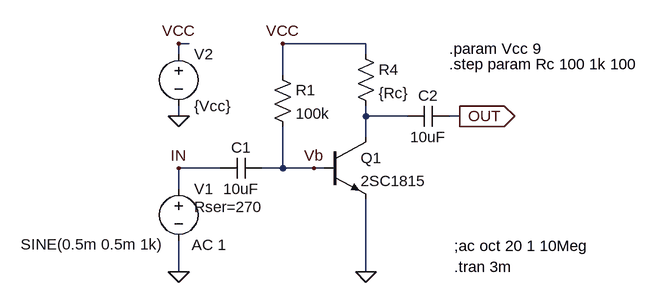
[diagram p0: schematic Fixed Base Biasing.asc]
Fixed Base Biasing.asc, the LTspice schematic file:
Version 4
SHEET 1 880 680
WIRE 16 -16 0 -16
WIRE 288 -16 160 -16
WIRE 0 0 0 -16
WIRE 288 0 288 -16
WIRE 160 32 160 -16
WIRE 0 96 0 80
WIRE 288 96 288 80
WIRE 352 96 288 96
WIRE 432 96 416 96
WIRE 288 128 288 96
WIRE 64 176 0 176
WIRE 160 176 160 112
WIRE 160 176 128 176
WIRE 208 176 160 176
WIRE 224 176 208 176
WIRE 0 208 0 176
WIRE 0 336 0 288
WIRE 288 336 288 224
FLAG 0 336 0
FLAG 288 336 0
FLAG 432 96 OUT
IOPIN 432 96 Out
FLAG 160 -16 VCC
FLAG 0 96 0
FLAG 0 -16 VCC
FLAG 0 176 IN
FLAG 208 176 Vb
SYMBOL npn 224 128 R0
SYMATTR InstName Q1
SYMATTR Value 2SC1815
SYMBOL cap 128 160 R90
WINDOW 0 0 32 VBottom 2
WINDOW 3 32 32 VTop 2
SYMATTR InstName C1
SYMATTR Value 10uF
SYMBOL res 144 16 R0
SYMATTR InstName R1
SYMATTR Value 100k
SYMBOL voltage 0 192 R0
WINDOW 3 -24 101 Right 2
WINDOW 123 20 102 Left 2
WINDOW 39 24 44 Left 2
SYMATTR Value SINE(0.5m 0.5m 1k)
SYMATTR Value2 AC 1
SYMATTR SpiceLine Rser=270
SYMATTR InstName V1
SYMBOL res 272 -16 R0
SYMATTR InstName R4
SYMATTR Value {Rc}
SYMBOL voltage 0 -16 R0
WINDOW 123 0 0 Left 2
WINDOW 39 0 0 Left 2
SYMATTR InstName V2
SYMATTR Value {Vcc}
SYMBOL cap 416 80 R90
WINDOW 0 0 32 VBottom 2
WINDOW 3 32 32 VTop 2
SYMATTR InstName C2
SYMATTR Value 10uF
TEXT 424 328 Left 2 !.tran 3m
TEXT 424 296 Left 2 !;ac oct 20 1 10Meg
TEXT 416 -8 Left 2 !.param Vcc 9
TEXT 416 16 Left 2 !.step param Rc 100 1k 100

The netlist it stands for:
* Fixed Base Biasing.asc
Q1 N001 Vb 0 0 2SC1815
C1 Vb IN 10uF
R1 VCC Vb 100k
V1 IN 0 SINE(0.5m 0.5m 1k) AC 1 Rser=270
R4 VCC N001 {Rc}
V2 VCC 0 {Vcc}
C2 OUT N001 10uF
.model NPN NPN
.model PNP PNP
.lib standard.bjt
.tran 3m
;ac oct 20 1 10Meg
.param Vcc 9
.step param Rc 100 1k 100
.backanno
.end